# EAGLE design 1.1_nano-revision ssop crystal (EAGLE 5.11)
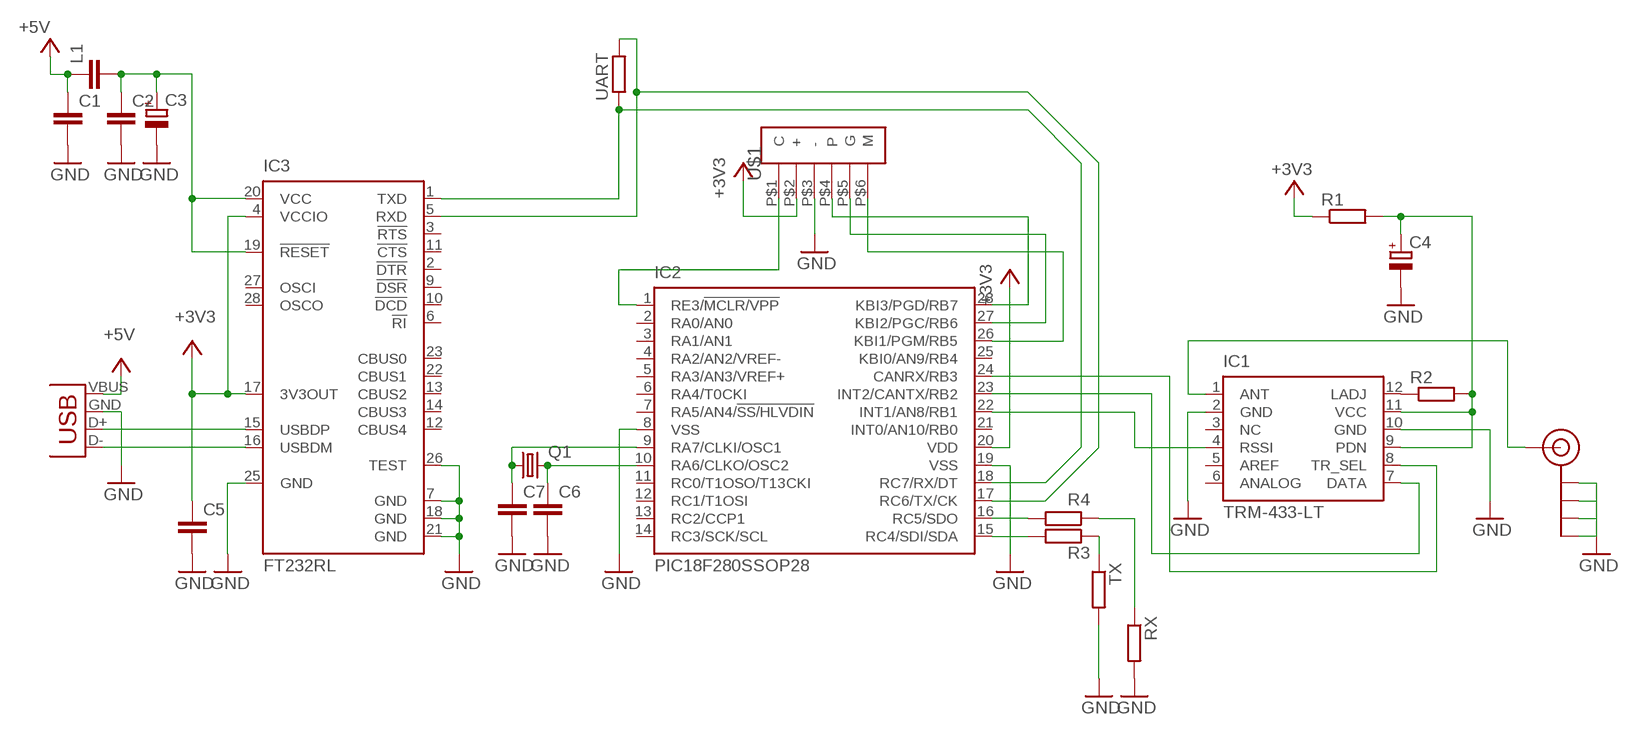
[diagram p0: schematic, sheet 1]

## Parts
C1  C-EUC0805K  [C0805K]
C2  C-EUC0805K  [C0805K]
C3  CPOL-EUCT6032  [CT6032]
C4  CPOL-EUCT6032  [CT6032]
C5  C-EUC0805K  [C0805K]
C6  C-EUC0805K  [C0805K]
C7  C-EUC0805K  [C0805K]
IC1  TRM-433-LT  [TRM-XXX-LT]
IC2  PIC18F280SSOP28  [SSOP28]
IC3  FT232RL  [SSOP28]
J$1  SMA_EDGE  [SMA-EDGE]
L1  C-EUC0805K  [C0805K]
Q1  CRYSTALSM49  [SM49]
R1  R-EU_M0805  [M0805]
R2  R-EU_M0805  [M0805]
R3  R-EU_M0805  [M0805]
R4  R-EU_M0805  [M0805]
RX  R-EU_M0805  [M0805]
TX  R-EU_M0805  [M0805]
U$1  ICSP_HDR_SMDSMALL  [6-PINSMDSMALL]
UART  R-EU_R0603  [R0603]
X1  USB-A-H  [USB-A-H]

## Nets
+3V3: C4.+ C5.1 IC1.9(PDN) IC1.11(VCC) IC2.20(VDD) IC3.4(VCCIO) IC3.17(3V3OUT) R1.1 R1.2 R2.2 U$1.P$2(+)
+5V: C1.1 L1.1 X1.VBUS(GND)
GND: C1.2 C2.2 C3.- C4.- C5.2 C6.2 C7.2 IC1.2(GND) IC1.10(GND) IC2.8(VSS) IC2.19(VSS) IC3.7(GND) IC3.18(GND) IC3.21(GND) IC3.25(GND) IC3.26(TEST) J$1.GND@0(GND) J$1.GND@1(GND) J$1.GND@2(GND) J$1.GND@3(GND) RX.2 TX.2 U$1.P$3(-) X1.GND(VBUS)
N$1: IC1.1(ANT) J$1.SIG(SIGNAL)
N$2: IC2.18(RC7/RX/DT) IC3.1(TXD) UART.1
N$3: IC2.17(RC6/TX/CK) IC3.5(RXD) UART.2
N$4: IC2.1(RE3/!MCLR/VPP) U$1.P$1(C)
N$5: IC2.28(KBI3/PGD/RB7) U$1.P$4(P)
N$6: IC2.27(KBI2/PGC/RB6) U$1.P$5(G)
N$7: IC2.26(KBI1/PGM/RB5) U$1.P$6(M)
N$8: IC1.7(DATA) IC2.23(INT2/CANTX/RB2)
N$9: IC1.8(TR_SEL) IC2.24(CANRX/RB3)
N$10: IC1.4(RSSI) IC2.22(INT1/AN8/RB1)
N$11: IC1.12(LADJ) R2.1
N$12: IC3.16(USBDM) X1.D-(D+)
N$13: IC2.16(RC5/SDO) R4.2
N$14: IC3.15(USBDP) X1.D+(D-)
N$15: IC2.15(RC4/SDI/SDA) R3.2
N$16: C2.1 C3.+ IC3.19(!RESET) IC3.20(VCC) L1.2
N$17: C6.1 IC2.10(RA6/CLKO/OSC2) Q1.2
N$18: R4.1 RX.1
N$19: R3.1 TX.1
N$24: C7.1 IC2.9(RA7/CLKI/OSC1) Q1.1
Unconnected: IC1.3(NC) IC1.5(AREF) IC1.6(ANALOG) IC2.2(RA0/AN0) IC2.3(RA1/AN1) IC2.4(RA2/AN2/VREF-) IC2.5(RA3/AN3/VREF+) IC2.6(RA4/T0CKI) IC2.7(RA5/AN4/!SS/HLVDIN) IC2.11(RC0/T1OSO/T13CKI) IC2.12(RC1/T1OSI) IC2.13(RC2/CCP1) IC2.14(RC3/SCK/SCL) IC2.21(INT0/AN10/RB0) IC2.25(KBI0/AN9/RB4) IC3.2(!DTR) IC3.3(!RTS) IC3.6(!RI) IC3.9(!DSR) IC3.10(!DCD) IC3.11(!CTS) IC3.12(CBUS4) IC3.13(CBUS2) IC3.14(CBUS3) IC3.22(CBUS1) IC3.23(CBUS0) IC3.27(OSCI) IC3.28(OSCO)

## Library data of the parts
C1 C2 C5-C7 L1 = rcl:C-EU: CAPACITOR, European symbol
C3 C4 = rcl:CPOL-EU: POLARIZED CAPACITOR, European symbol
IC1 = linx:TRM-*-LT: LT SERIES TRANSCEIVER MODULE bidirectional wireless transfer serial data Source: www.linxtechnologies.com .. TRM-xxx-LT_Data_Guide.pdf; OC_FARNELL: unknown; OC_NEWARK: unknown
IC2 = 00microchipedit:PIC18F2*80: 28-Pin Enhanced Flash Microcontrollers with ECAN(TM) Technology 10-Bit A/D and nanoWatt Technology Source: http://www.microchip.com .. 39637a.pdf
IC3 = ftdichip:FT232R: Source: http://www.ftdichip.com/Documents/DataSheets/DS_FT232R_v104.pdf; MPN: FT232RL; OC_FARNELL: 1146032; OC_NEWARK: 91K9918
J$1 = SparkFun:SMA_EDGE: SMA Antenna Connector End launch SMA connector. The paste layer has been removed so that the connector can be hand soldered onto the board after reflow.
Q1 = crystal:CRYSTAL: CRYSTAL; OC_FARNELL: unknown; OC_NEWARK: unknown
R1-R4 RX TX = rcl:R-EU_: RESISTOR, European symbol
U$1 = 6pin2mmheader:ICSP_HDR_SMDSMALL
UART = resistor:R-EU_: RESISTOR, European symbol
X1 = SparkFun:USB: USB Connectors USB-B-PTH is fully proven SKU : PRT-00139 USB-miniB is fully proven SKU : PRT-00587 USB-A-PCB is untested. USB-A-H is throughly reviewed, but untested. Spark Fun Electronics SKU : PRT-00437 USB-B-SMT is throughly reviewed, but untested. Needs silkscreen touching up. USB-A-S has not been used/tested USB-MB-H has not been used/tested

## Board
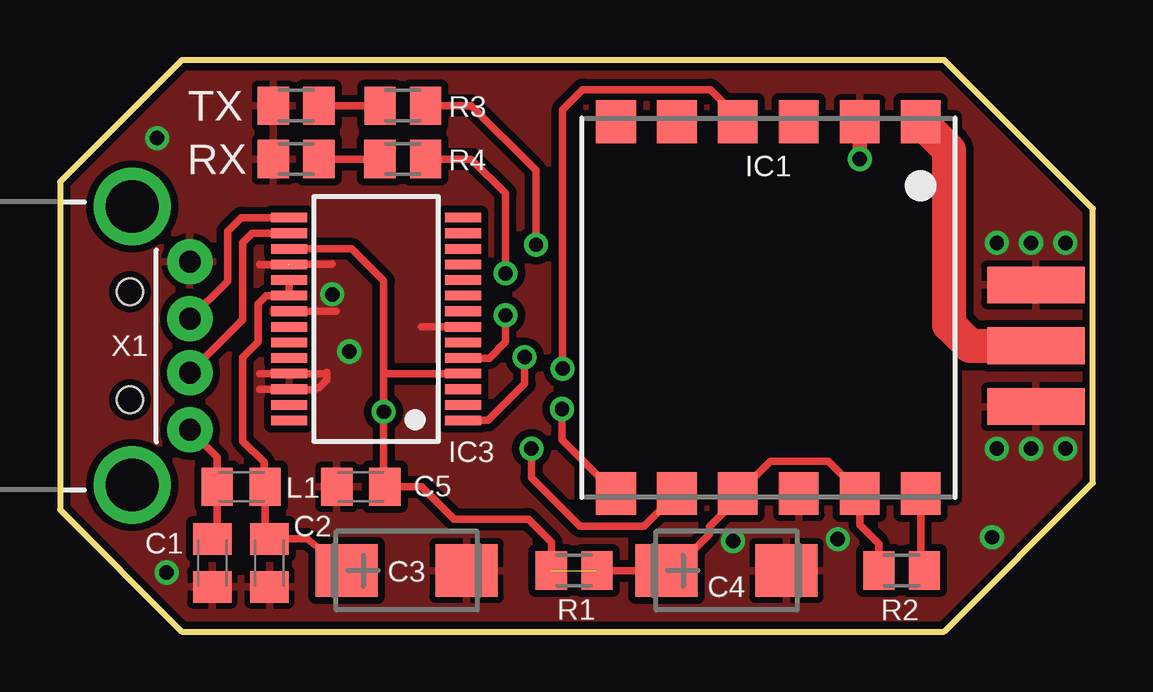
[diagram p1: board, top side]
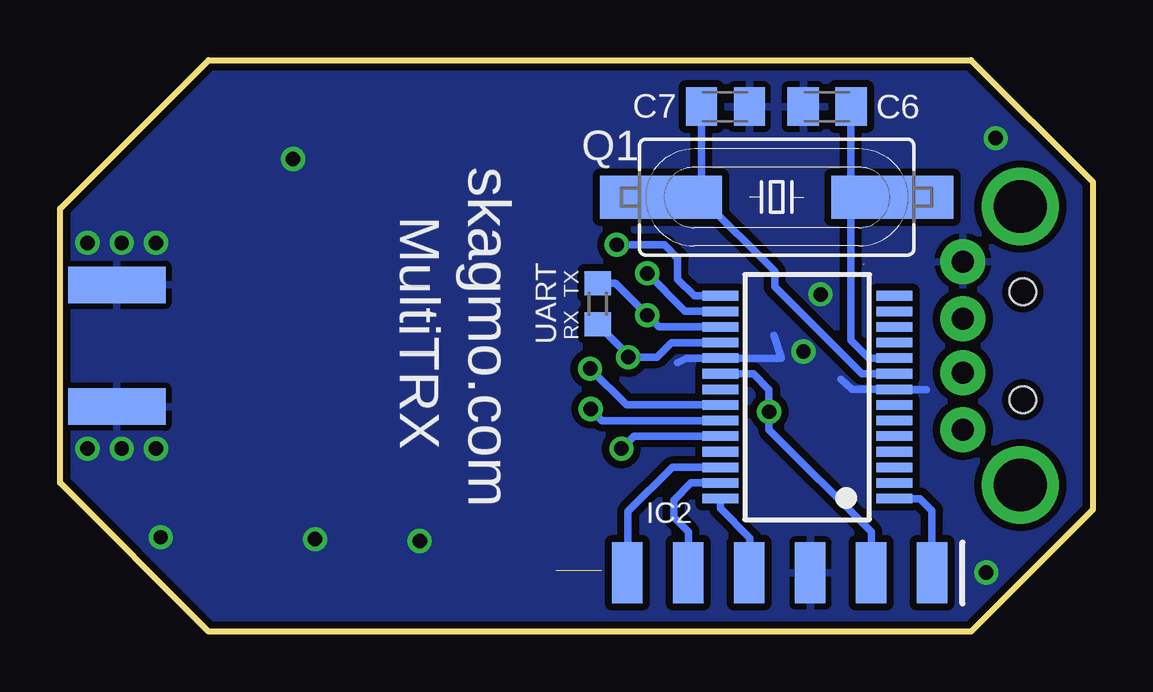
[diagram p2: board, bottom side, seen from below]

Size 43.05 x 23.81 mm. Coordinates in mm from the lower left corner, seen from the top.
Outline: 0,18.73 0,5.08 5.08,0 36.86,0 43.05,6.19 43.05,17.62 36.86,23.81 5.08,23.81 0,18.73
Copper layers (1*16): Top 0.035mm / dielectric 1.5mm / Bottom 0.035mm
Design rules "default *": minimum track width 10mil, minimum drill 24mil, track to track 8mil, track to pad 8mil, pad to pad 8mil, via to via 8mil, smd to smd 8mil, copper to edge 8mil, drill to drill 8mil, minimum pad ring 10mil, minimum via ring 8mil, stop-mask expansion 4mil, vias tented up to drill 0.8mm, thermal gap 10mil
tRestrict: area 21.7,5.6 to 37.3,21.4; 9 lines
bRestrict: 7 lines

### Footprints (pad centres in the part's own frame; a part is rotated, then mirrored left to right if it is on the bottom)
C0805K = smd 1.3 x 1.6: 1 -1,0; 2 1,0
CT6032 = smd 2.6 x 2.2: + -2.5,0; - 2.5,0
TRM-XXX-LT = smd 1.651 x 1.778: 1 -6.35,-7.747; 2 -3.81,-7.747; 3 -1.27,-7.747; 4 1.27,-7.747; 5 3.81,-7.747; 6 6.35,-7.747; 7 6.35,7.747; 8 3.81,7.747; 9 1.27,7.747; 10 -1.27,7.747; 11 -3.81,7.747; 12 -6.35,7.747
SSOP28 = smd 0.4 x 1.5: 1 -4.225,-3.625; 2 -3.575,-3.625; 3 -2.925,-3.625; 4 -2.275,-3.625; 5 -1.625,-3.625; 6 -0.975,-3.625; 7 -0.325,-3.625; 8 0.325,-3.625; 9 0.975,-3.625; 10 1.625,-3.625; 11 2.275,-3.625; 12 2.925,-3.625; 13 3.575,-3.625; 14 4.225,-3.625; 15 4.225,3.625; 16 3.575,3.625; 17 2.925,3.625; 18 2.275,3.625; 19 1.625,3.625; 20 0.975,3.625; 21 0.325,3.625; 22 -0.325,3.625; 23 -0.975,3.625; 24 -1.625,3.625; 25 -2.275,3.625; 26 -2.925,3.625; 27 -3.575,3.625; 28 -4.225,3.625
SMA-EDGE = smd 1.524 x 4.064: GND@0 0,0; GND@1 5.08,0; SIG 2.54,0 | smd 1.524 x 4.064 bottom: GND@2 0,0; GND@3 5.08,0
SM49 = smd 5.08 x 1.778: 1 -4.826,0; 2 4.826,0
M0805 = smd 1.3 x 1.6: 1 -0.95,0; 2 0.95,0
6-PINSMDSMALL = smd 1.27 x 2.54: P$1 0,0; P$2 2.54,0; P$3 5.08,0; P$4 7.62,0; P$5 10.16,0; P$6 12.7,0
R0603 = smd 1 x 1.1: 1 -0.85,0; 2 0.85,0
USB-A-H = drill 0.914 pad 1.88 round: D+ 2.4,1.127; D- 2.4,-1.127; GND 2.4,3.5; VBUS 2.4,-3.5 | drill 2.2 round: GND2 0,-5.8; GND3 0,5.8 | hole 1.1: -0.1,2.25; -0.1,-2.25

### Placement (x,y rotation side)
C1  6.35,2.86 270 top
C2  8.73,2.86 270 top
C3  14.45,2.54 0 top
C4  27.78,2.54 0 top
C5  12.54,6.03 180 top
C6  11.07,21.87 180 bottom
C7  15.32,21.87 0 bottom
IC1  29.53,13.49 180 top
IC2  11.91,9.77 90 bottom
IC3  13.18,13.02 90 top
J$1  40.68,9.37 90 top
L1  7.56,6.03 0 top
Q1  13.18,18.1 0 bottom
R1  21.43,2.54 0 top
R2  35.08,2.54 180 top
R3  14.29,21.91 0 top
R4  14.29,19.69 0 top
RX  9.84,19.69 180 top
TX  9.84,21.91 180 top
U$1  6.7,2.44 180 bottom
UART  20.64,13.65 90 bottom
X1  3.02,11.91 0 top

### Tracks (layer width: path | path; a pad name or v marks a point on that pad's centre or on a via)
+3V3  (via drill 0.6)  (1 unrouted)
  Top 0.305: R1.2 C4.+ 26.03,2.54 26.11,2.62 26.11,3.1 27.07,4.05 27.07,4.37 28.26,5.56 IC1.9 29.61,7.1 32.03,7.1 33.34,5.79 IC1.11 33.34,4.44 34.13,3.65 R2.2 | R1.1 20.48,3.73 19.53,4.68 16.43,4.68 15.08,6.03 C5.1 13.49,6.08 v13.49,9.15 | IC3.17 12.16,15.94 13.49,14.6 v13.49,9.15 | IC3.4 13.49,10.74 v13.49,9.15
  Bottom 0.305: U$1.P$2 9.24,4.16 13.49,8.41 v13.49,9.15 13.49,10.08 14.15,10.74 IC2.20
+5V
  Top 0.305: X1.VBUS 6.56,7.27 L1.1 6.56,3.87 C1.1
GND  (via drill 0.6)  (1 unrouted)
  Top 0.305: IC3.7 15.09,12.69 15.08,12.7 | IC3.25 11.06,10.74 11.11,10.79 11.11,10.48 10.79,10.16 10.72,10.16 10.64,10.08 9.6,10.08 | IC3.18 11.32,15.29 11.35,15.32 | IC3.21 11.5,13.34 11.51,13.33 | 9.53,15.28 8.33,15.28 8.33,15.29 | 9.16,10.73 8.32,10.73 8.32,10.74 | 9.13,10.09 8.32,10.09
  Bottom 0.305: 17.3,11.19 16.95,11.39 IC2.19 12.99,11.39 13.3,12.34 | IC2.8 10.04,10.09 10.5,10.5 | 6.95,10.08 7.86,10.08
  other vias: 41.91,16.19 41.91,7.62 11.35,14.05 38.85,3.93 32.42,3.85 33.34,19.69 4.05,20.56 4.44,2.46 40.48,16.19 40.48,7.62 39.05,16.19 39.05,7.62 28.06,3.77 12.07,11.67
  pour Top (isolate 0.305): 0.1,5.11 0.06,18.73 5.05,23.72 36.61,23.81 43.05,17.88 42.89,5.94 36.96,0 4.92,0.03
  pour Bottom (isolate 0.305): 0,18.73 5.11,23.81 36.7,23.81 43.05,17.62 43.15,6.03 36.96,0 5.08,0 0.1,5.02
N$1
  Top 1.422: J$1.SIG 37.94,11.91 37.07,12.78 37.07,20.05 IC1.1
N$2  (via drill 0.6)
  Top 0.305: IC3.1 17.84,8.79 19.37,10.32 v19.37,11.43
  Bottom 0.305: IC2.18 17.57,12.04 18.18,11.43 v19.37,11.43 19.37,11.53 UART.1
N$3  (via drill 0.6)
  Top 0.305: IC3.5 17.9,11.39 18.57,12.06 v18.57,13.18
  Bottom 0.305: IC2.17 18.09,12.69 v18.57,13.18 19.9,14.5 UART.2
N$4
  Bottom 0.305: IC2.1 7.21,5.54 6.7,5.03 U$1.P$1
N$5
  Bottom 0.305: U$1.P$4 14.29,2.63 14.29,3.89 15.53,5.13 IC2.28
N$6
  Bottom 0.305: U$1.P$5 16.86,4.16 17.46,4.76 17.46,5.48 16.75,6.19 IC2.27
N$7
  Bottom 0.305: U$1.P$6 19.37,2.48 19.37,5 17.53,6.84 IC2.26
N$8  (via drill 0.6)
  Top 0.305: v20.93,9.27 20.93,8 IC1.7
  Bottom 0.305: IC2.23 20.46,8.79 v20.93,9.27
N$9  (via drill 0.6)
  Top 0.305: 25.72,5.71 IC1.8 24.35,4.38 21.69,4.38 19.65,6.41 v19.65,7.62
  Bottom 0.305: IC2.24 19.13,8.14 v19.65,7.62
N$10  (via drill 0.6)
  Top 0.305: v20.96,10.95 20.96,21.75 21.79,22.58 27.11,22.58 28.26,21.43 IC1.4
  Bottom 0.305: IC2.22 19.44,9.44 v20.96,10.95
N$11
  Top 0.305: IC1.12 35.88,2.7 R2.1
N$12
  Top 0.305: X1.D- 7.62,12.98 7.62,16.19 8.02,16.59 IC3.16
N$13  (via drill 0.6)
  Top 0.305: R4.2 17.14,19.68 18.57,18.26 v18.57,14.92
  Bottom 0.305: IC2.16 16.99,13.34 v18.57,14.92
N$14
  Top 0.305: X1.D+ 6.98,14.6 6.98,16.67 7.56,17.24 IC3.15
N$15  (via drill 0.6)
  Top 0.305: v19.84,16.11 19.84,19.21 17.14,21.91 R3.2
  Bottom 0.305: IC2.15 16.61,13.99 17.3,14.68 17.3,15.56 17.86,16.11 v19.84,16.11
N$16
  Top 0.305: C3.+ 10.31,3.86 C2.1 8.56,3.87 L1.2 8.51,5.83 8.51,7.05 7.62,7.94 7.62,11.43 8.26,12.06 8.26,13.65 8.59,13.99 IC3.20 IC3.19
N$17
  Bottom 0.305: IC2.10 9.33,11.39 10.08,12.14 10.08,18.02 | 10.08,18.02 10.08,21.86 C6.1 | Q1.2 10,18.1 10.08,18.02
N$18
  Top 0.305: RX.1 R4.1
N$19
  Top 0.305: TX.1 R3.1 | R3.1
N$22
  Top 0.61: 33.34,19.68 33.34,20.88
N$24
  Bottom 0.305: 16.32,18.05 16.35,18.02 17.92,18.02 Q1.1 | 16.32,18.05 16.3,18.05 13.26,15 13.26,14.37 9.63,10.74 IC2.9 | 16.32,18.05 C7.1

### Text on the board
_bsilk: skagmo.com | MultiTRX | TX | RX